# EAGLE design keyboard-adapter-v1.2 (EAGLE 9.6.2)
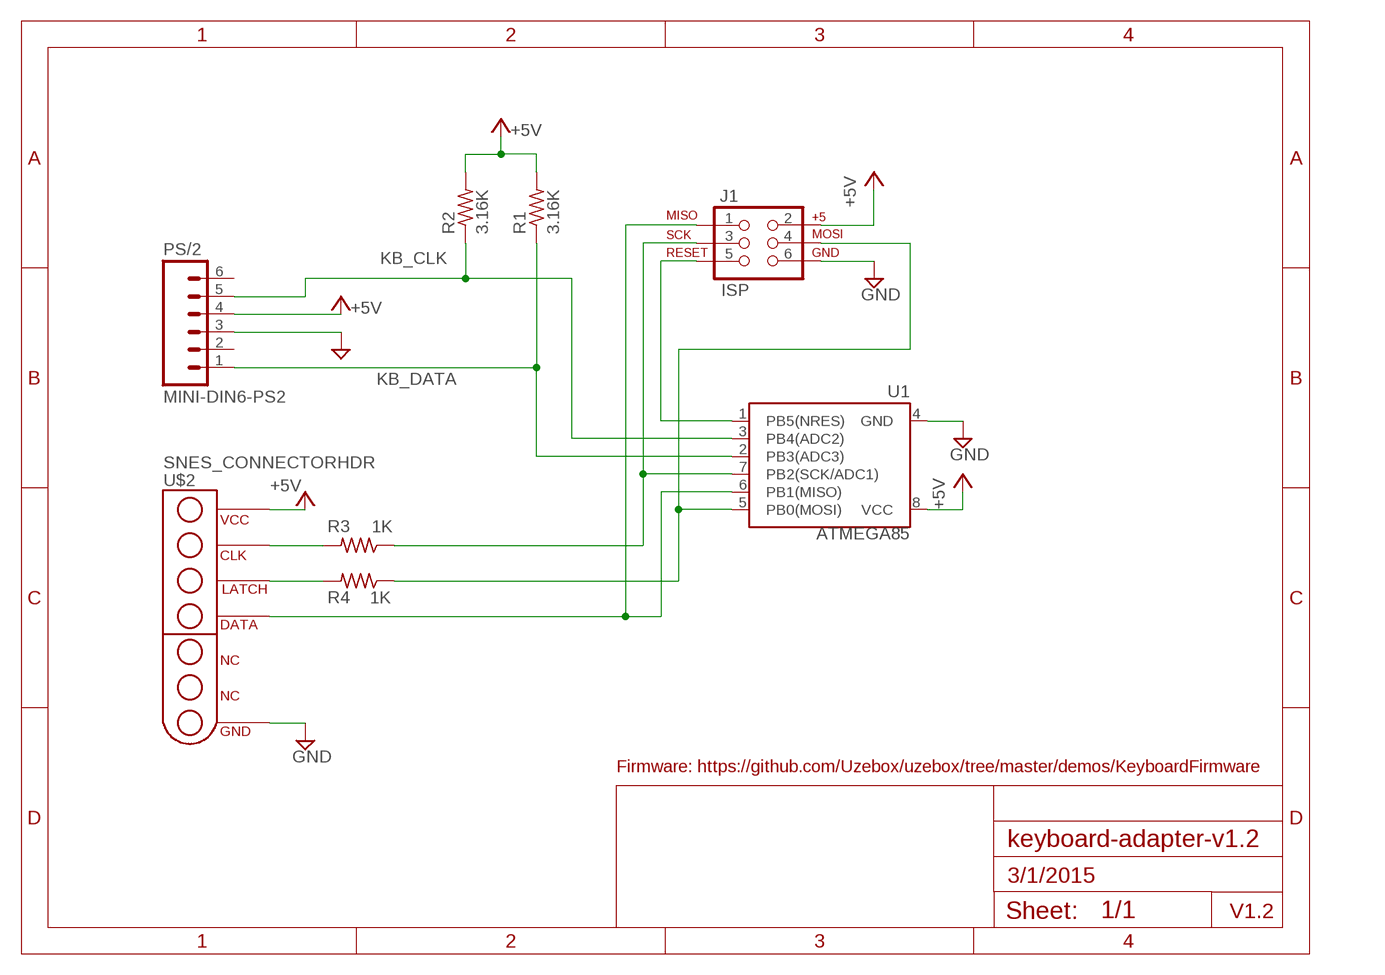
[diagram p0: schematic, sheet 1]
FRAME1 (DINA5_L): LAST_DATE_TIME: 3/1/2015

## Parts
ATMEGA85  U1  ATTINY45DIP8  [DIP762W53P254L927H508Q8B]
J1  ISP  AVR_SPI_PRG_6-V2PTH  [2X3]
PS/2  MINI-DIN6-PS2  MINI-DIN6PTH  [MINI-DIN6]
R1  3.16K  R-US_0207/10  [0207/10]
R2  3.16K  R-US_0207/10  [0207/10]
R3  1K  R-US_0207/10  [0207/10]
R4  1K  R-US_0207/10  [0207/10]
U$2  SNES_CONNECTORHDR  [SNES_CONN-HDR5]

## Nets
+5V: ATMEGA85.8(VCC) J1.2 PS/2.4 R1.2 R2.2 U$2.P$5(VCC)
GND: ATMEGA85.4(GND) J1.6 PS/2.3 U$2.P$1(GND)
KB_CLK: ATMEGA85.3(PB4(ADC2)) PS/2.5 R2.1
KB_DATA: ATMEGA85.2(PB3(ADC3)) PS/2.1 R1.1
MISO: ATMEGA85.6(PB1(MISO)) J1.1 U$2.P$2(DATA)
MOSI: ATMEGA85.5(PB0(MOSI)) J1.4 R4.1
RESET: ATMEGA85.1(PB5(NRES)) J1.5
S_CLK: R3.2 U$2.P$4(CLK)
S_LATCH: R4.2 U$2.P$3(LATCH)
SCK: ATMEGA85.7(PB2(SCK/ADC1)) J1.3 R3.1
Unconnected: PS/2.2 PS/2.6

## Notes on the sheet
- Firmware: https://github.com/Uzebox/uzebox/tree/master/demos/KeyboardFirmware
- V1.2

## Library data of the parts
ATMEGA85 = uzebox:ATTINY45: Atmel 8-pin 2/4/8kB flash uC
J1 = uzebox:AVR_SPI_PRG_6-V2: AVR ISP 6 Pin This is the reduced ISP connector for AVR programming. Common on Arduino. This footprint will take up less PCB space and can be used with a 10-pin to 6-pin adapter such as SKU: BOB-08508
PS/2 = uzebox:MINI-DIN6: mini DIN 6 Connector Commonly found on the back of a computer for PS2 keyboard and mice. Schematic and footprint are proven. Spark Fun Electronics SKU : PRT-08509
R1-R4 = uzebox:R-US_: RESISTOR, American symbol
U$2 = uzebox:SNES_CONNECTOR: Generic SNES connector

## Net classes
0 default: width 0.381 mm

## Board
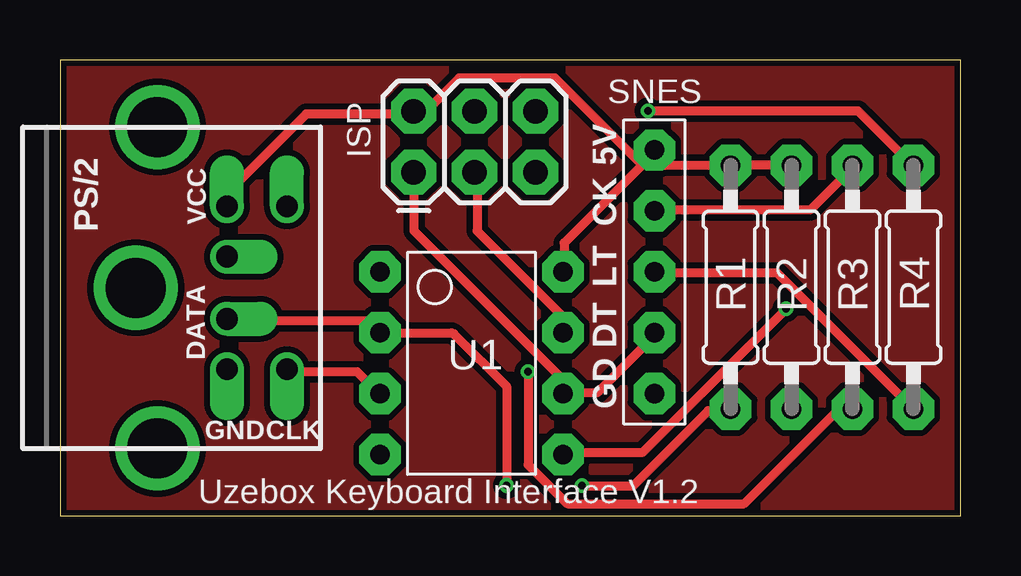
[diagram p1: board, top side]
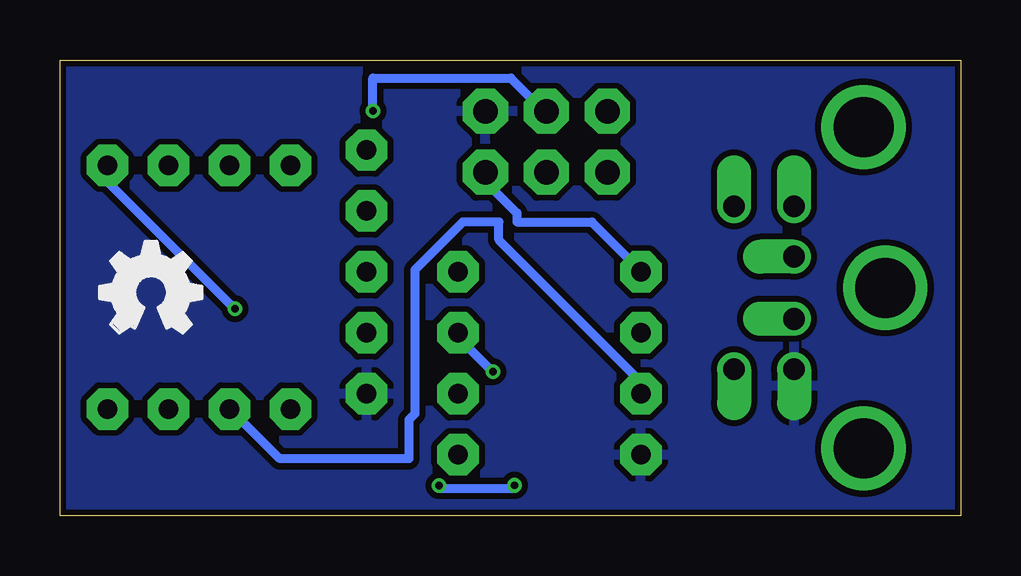
[diagram p2: board, bottom side, seen from below]

Size 37.54 x 19 mm. Coordinates in mm from the lower left corner, seen from the top.
Outline: 0,0 37.54,0 37.54,19 0,19 0,0
Copper layers (1*16): Top 0.035mm / dielectric 1.5mm / Bottom 0.035mm
Design rules "ITEADstudio_DRC_new": minimum track width 10mil, minimum drill 12mil, track to track 10mil, track to pad 10mil, pad to pad 10mil, via to via 10mil, smd to smd 0mil, copper to edge 10mil, drill to drill 10mil, minimum pad ring 10mil, minimum via ring 6mil, stop-mask expansion 2mil, vias tented up to drill 100mil, thermal gap 10mil

### Footprints (pad centres in the part's own frame; a part is rotated, then mirrored left to right if it is on the bottom)
DIP762W53P254L927H508Q8B = drill 0.813 pad 1.727 octagon: 1 -3.81,3.81; 2 -3.81,1.27; 3 -3.81,-1.27; 4 -3.81,-3.81; 5 3.81,-3.81; 6 3.81,-1.27; 7 3.81,1.27; 8 3.81,3.81
2X3 = drill 1.016 pad 1.88 octagon: 1 0,0; 2 0,2.54; 3 2.54,0; 4 2.54,2.54; 5 5.08,0; 6 5.08,2.54
MINI-DIN6 = drill 0.9 offset: 1 -1.3,-8.5; 2 1.3,-8.5; 4 3.4,-8.5; 5 -3.4,-11; 6 3.4,-11 | drill 0.9 pad 1.27 offset: 3 -3.4,-8.5 | drill 2.5: P$1 0,-4.7; P$2 -6.7,-5.6; P$3 6.7,-5.6
0207/10 = drill 0.813 pad 1.727 octagon: 1 -5.08,0; 2 5.08,0
SNES_CONN-HDR5 = drill 0.813 pad 1.727 octagon: P$1 0,0; P$2 2.54,0; P$3 5.08,0; P$4 7.62,0; P$5 10.16,0

### Placement (x,y rotation side)
ATMEGA85  17.14,6.35 0 top
J1  14.73,14.32 0 top
PS/2  -1.54,9.5 90 top
R1  27.94,9.53 90 top
R2  30.48,9.53 90 top
R3  33.02,9.53 90 top
R4  35.56,9.53 270 top
U$1  [OSHW_FILLX150_NOTEXT]  35.88,7.62 0 bottom
U$2  24.77,5.08 90 top

### Tracks (layer width: path | path; a pad name or v marks a point on that pad's centre or on a via)
+5V
  Top 0.381: PS/2.4 7,13 7,13.5 10.25,16.75 14.62,16.75 J1.2 14.88,16.88 15.25,16.88 16.62,18.25 20.62,18.25 24.12,14.75 U$2.P$5 | R2.2 30.38,14.62 28,14.62 R1.2 27.75,14.62 24.5,14.62 U$2.P$5 | ATMEGA85.8 21,10.25 21,11.38 24.75,15.12 U$2.P$5
GND
  pour Bottom: 0,19.05 37.47,19.05 37.47,0 0,0
KB_CLK
  Top 0.381: PS/2.5 9.5,6 12.38,6 13.25,5.12 ATMEGA85.3
  Bottom 0.381: R2.1 30.38,4.38 28.38,2.38 23,2.38 23,4 22.75,4.25 22.75,10.25 20.75,12.25 19.25,12.25 19.25,11.5 13.38,5.62 13.38,5.12 ATMEGA85.3
KB_DATA  (via drill 0.3)
  Top 0.381: PS/2.1 7,8.12 12.75,8.12 13.25,7.62 ATMEGA85.2 16.32,7.62 16.41,7.58 18.61,5.39 v18.61,1.26 | v21.75,1.25 23.88,1.25 27,4.38 27.88,4.38 R1.1
  Bottom 0.381: v21.75,1.25 21.64,1.14 18.73,1.14 v18.61,1.26
MISO
  Top 0.381: U$2.P$2 24.75,7.5 22.38,5.12 21,5.12 ATMEGA85.6 21.38,5.25 14.75,11.88 14.75,14.25 J1.1
MOSI  (via drill 0.3)
  Top 0.381: v30.25,8.62 24.25,2.62 21,2.62 ATMEGA85.5 | v24.5,16.88 33.25,16.88 35.5,14.62 R4.1
  Bottom 0.381: v30.25,8.62 35.5,13.88 35.5,14.5 R4.1 | v24.5,16.88 24.5,18.25 18.75,18.25 17.38,16.88 J1.4
RESET
  Bottom 0.381: ATMEGA85.1 13.38,10.25 15.38,12.25 18.5,12.25 18.5,12.62 19.75,13.88 19.75,14.25 J1.5
S_CLK
  Top 0.381: U$2.P$4 24.88,12.75 31.25,12.75 33,14.5 R3.2
S_LATCH
  Top 0.381: U$2.P$3 24.88,10.12 29.88,10.12 35.5,4.5 R4.2
SCK  (via drill 0.3)
  Top 0.381: ATMEGA85.7 20.88,7.62 20.88,8.38 17.38,11.88 17.38,14.25 J1.3 | v19.5,6 19.5,2.12 21.12,0.5 28.5,0.5 32.38,4.38 33,4.38 R3.1
  Bottom 0.381: v19.5,6 20.88,7.38 20.88,7.5 ATMEGA85.7
VCC
  pour Top: 0,19.05 37.47,19.05 37.47,0 0,0

### Text on the board
tPlace: 5V | CK | LT | DT | GD | Uzebox Keyboard Interface V1.2
tNames: SNES | VCC | DATA | GND | CLK